# EAGLE design controller v1 (EAGLE 6.4)
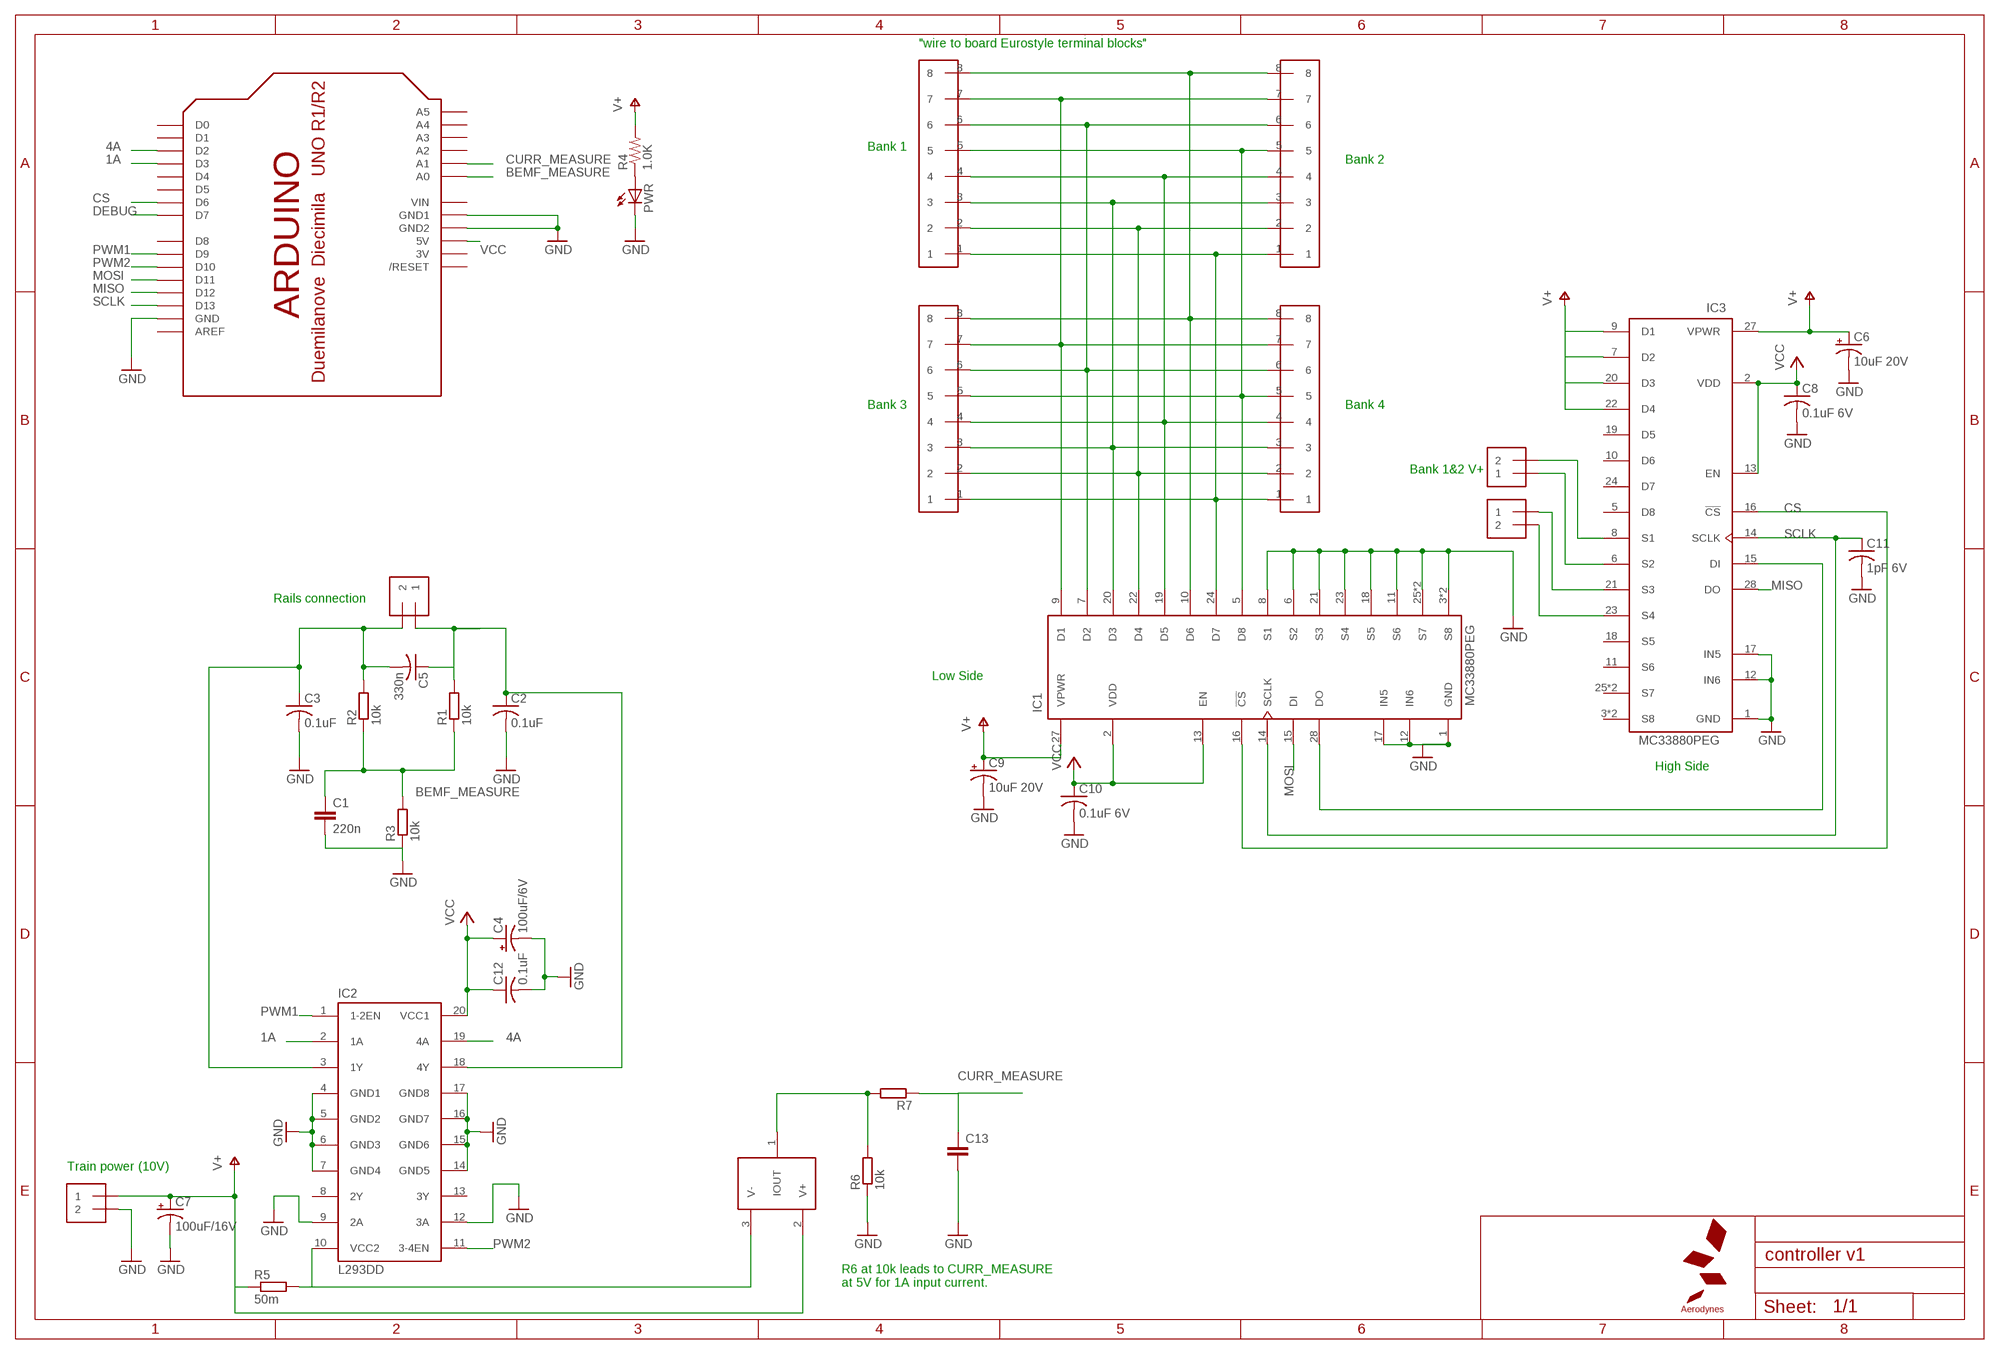
[diagram p0: schematic, sheet 1]

## Parts
BANK12  1X2-3.5MM  [1X2-3.5MM]
BANK34  1X2-3.5MM  [1X2-3.5MM]
C1  220n  C-EUC0805  [C0805]
C2  0.1uF  C-US025-025X050  [C025-025X050]
C3  0.1uF  C-US025-025X050  [C025-025X050]
C4  100uF/6V  CPOL-USE2.5-5  [E2,5-5]
C5  330n  C-US050-025X075  [C050-025X075]
C6  10uF 20V  CPOL-USE2,5-6E  [E2,5-6E]
C7  100uF/16V  CPOL-USE2.5-6  [E2,5-6]
C8  0.1uF 6V  C-US025-025X050  [C025-025X050]
C9  10uF 20V  CPOL-USE2,5-6E  [E2,5-6E]
C10  0.1uF 6V  C-US025-025X050  [C025-025X050]
C11  1pF 6V  C-USC0805K  [C0805K]
C12  0.1uF  C-US025-025X050  [C025-025X050]
C13  C-EUC0805K  [C0805K]
CON1  1X08-CONN3.5MM  [1X08-3.5MM]
CON2  1X08-CONN3.5MM  [1X08-3.5MM]
CON3  1X08-CONN3.5MM  [1X08-3.5MM]
CON4  1X08-CONN3.5MM  [1X08-3.5MM]
IC1  MC33880PEG  [SO28W]
IC2  L293DD  [SOIC20-2]
IC3  MC33880PEG  [SO28W]
PWR  LED3MM  [LED3MM]
R1  10k  R-EU_R0805  [R0805]
R2  10k  R-EU_R0805  [R0805]
R3  10k  R-EU_R0805  [R0805]
R4  1.0K  R-US_M0805  [M0805]
R5  50m  R-EU_M1206  [M1206]
R6  10k  R-EU_R0603  [R0603]
R7  R-EU_R0603  [R0603]
SL1  1X2-3.5MM  [1X2-3.5MM]
SL2  1X2-3.5MM  [1X2-3.5MM]
U$1  ARDUINO  [ARDUINO-NOCUT]
U$2  LOGO-AERODYNESSMALL  [LOGO-AERODYNES-S]
U$3  ZXCT1009-F  [SOT23-1TOP]

## Nets
1A: IC2.2(1A) U$1.D3
1Y: C3.1 C5.2 IC2.3(1Y) R2.2 SL1.2
4A: IC2.19(4A) U$1.D2
4Y: C2.1 C5.1 IC2.18(4Y) R1.2 SL1.1
BEMF_MEASURE: C1.1 R1.1 R2.1 R3.2 U$1.A0
CS: IC1.16(!CS) IC3.16(!CS) U$1.D6
CURR_MEASURE: C13.1 R7.1 U$1.A1
DEBUG: U$1.D7
GND: C1.2 C2.2 C3.2 C4.- C6.- C7.- C8.2 C9.- C10.2 C11.2 C12.2 C13.2 IC1.1(GND) IC1.3(S8) IC1.4(S8) IC1.6(S2) IC1.8(S1) IC1.11(S6) IC1.12(IN6) IC1.17(IN5) IC1.18(S5) IC1.21(S3) IC1.23(S4) IC1.25(S7) IC1.26(S7) IC2.4(GND1) IC2.5(GND2) IC2.6(GND3) IC2.7(GND4) IC2.9(2A) IC2.12(3A) IC2.14(GND5) IC2.15(GND6) IC2.16(GND7) IC2.17(GND8) IC3.1(GND) IC3.12(IN6) IC3.17(IN5) PWR.K(C) R3.1 R6.1 SL2.2 U$1.GND U$1.GND1 U$1.GND2
MISO: IC3.28(DO) U$1.D12
MOSI: IC1.15(DI) U$1.D11
N$1: BANK34.2 IC3.23(S4)
N$2: BANK34.1 IC3.21(S3)
N$3: BANK12.1 IC3.6(S2)
N$4: BANK12.2 IC3.8(S1)
N$5: IC2.10(VCC2) R5.2 U$3.3(V-)
N$6: R6.2 R7.2 U$3.1(IOUT)
N$7: CON1.3 CON2.3 CON3.3 CON4.3 IC1.20(D3)
N$8: CON1.4 CON2.4 CON3.4 CON4.4 IC1.19(D5)
N$9: CON1.5 CON2.5 CON3.5 CON4.5 IC1.5(D8)
N$11: CON1.1 CON2.1 CON3.1 CON4.1 IC1.24(D7)
N$12: CON1.8 CON2.8 CON3.8 CON4.8 IC1.10(D6)
N$13: IC1.28(DO) IC3.15(DI)
N$14: CON1.7 CON2.7 CON3.7 CON4.7 IC1.9(D1)
N$15: CON1.2 CON2.2 CON3.2 CON4.2 IC1.22(D4)
N$16: CON1.6 CON2.6 CON3.6 CON4.6 IC1.7(D2)
N$35: PWR.A R4.1
PWM1: IC2.1(1-2EN) U$1.D9
PWM2: IC2.11(3-4EN) U$1.D10
SCLK: C11.1 IC1.14(SCLK) IC3.14(SCLK) U$1.D13
V+: C6.+ C7.+ C9.+ IC1.27(VPWR) IC3.7(D2) IC3.9(D1) IC3.20(D3) IC3.22(D4) IC3.27(VPWR) R4.2 R5.1 SL2.1 U$3.2(V+)
VCC: C4.+ C8.1 C10.1 C12.1 IC1.2(VDD) IC1.13(EN) IC2.20(VCC1) IC3.2(VDD) IC3.13(EN) U$1.5V
Unconnected: IC2.8(2Y) IC2.13(3Y) IC3.3(S8) IC3.4(S8) IC3.5(D8) IC3.10(D6) IC3.11(S6) IC3.18(S5) IC3.19(D5) IC3.24(D7) IC3.25(S7) IC3.26(S7) U$1.A2 U$1.A3 U$1.A4 U$1.A5 U$1.AREF U$1.D0 U$1.D1 U$1.D4 U$1.D5 U$1.D8 U$1.RESET(/RESET)

## Notes on the sheet
- "wire to board Eurostyle terminal blocks"
- Bank 1
- Bank 2
- Bank 3 | Bank 4
- Bank 1&2 V+
- Rails connection
- Low Side
- High Side
- Train power (10V)
- R6 at 10k leads to CURR_MEASURE
  at 5V for 1A input current.

## Power pins joined to a net without a drawn wire
3V: U$1.3V
VIN: U$1.VIN

## Library data of the parts
BANK12 BANK34 SL1 SL2 = adafruit:1X2: 3.5mm Terminal block http://www.ladyada.net/library/pcb/eaglelibrary.html
C1 C13 = resistor:C-EU: CAPACITOR, European symbol
C2 C3 C8 C10-C12 = rcl-ez:C-US: CAPACITOR, American symbol
C4 = adafruit:CPOL-US: POLARIZED CAPACITOR, American symbol
C5 = adafruit:C-US: CAPACITOR, American symbol
C6 C9 = rcl:CPOL-US: POLARIZED CAPACITOR, American symbol
C7 = rcl-ez:CPOL-US: POLARIZED CAPACITOR, American symbol
CON1-CON4 = aerodynes:1X08-CONN: Generic 3.5mm pitch screw connector, 8 plots.
IC1 IC3 = aerodynes:MC33880: Freescale 33880 The 33880 device is an 8-output hardware configurable high side/ low side switch with 8-bit serial input control using the serial peripheral interface (SPI). Two of the outputs can be controlled directly via microcontroller for pulse-width modulation (PWM) applications. The 33880 controls various inductive or incandescent loads by directly interfacing with a microcontroller. The circuit's innovative monitoring and protection features include very low standby currents, “cascadable” fault reporting, internal 40 V output clamping for low side configurations, internal -20 V output clamping for high side configurations, output specific diagnostics, and independent shutdown of outputs.
IC2 = aerodynes:L293D: The Device is a monolithic integrated high voltage, high current four channel driver designed to accept standard DTL or TTL logic levels and drive inductive loads (such as relays solenoides, DC and stepping motors) and switching power transistors. To simplify use as two bridges each pair of channels is equipped with an enable input. A separate supply input is provided for the logic, allowing operation at a lower voltage and internal clamp diodes are included. This device is suitable for use in switching applications at frequencies up to 5 kHz.
PWR = minimidi:LED: LED OSRAM: - CHIPLED LG R971, LG N971, LY N971, LG Q971, LY Q971, LO R971, LY R971 LH N974, LH R974 LS Q976, LO Q976, LY Q976 LO Q996 - Hyper CHIPLED LW Q18S LB Q993, LB Q99A, LB R99A - SideLED LS A670, LO A670, LY A670, LG A670, LP A670 LB A673, LV A673, LT A673, LW A673 LH A674 LY A675 LS A676, LA A676, LO A676, LY A676, LW A676 LS A679, LY A679, LG A679 - Hyper Micro SIDELED® LS Y876, LA Y876, LO Y876, LY Y876 LT Y87S - SmartLED LW L88C, LW L88S LB L89C, LB L89S, LG L890 LS L89K, LO L89K, LY L89K LS L896, LA L896, LO L896, LY L896 - TOPLED LS T670, LO T670, LY T670, LG T670, LP T670 LSG T670, LSP T670, LSY T670, LOP T670, LYG T670 LG T671, LOG T671, LSG T671 LB T673, LV T673, LT T673, LW T673 LH T674 LS T676, LA T676, LO T676, LY T676, LB T676, LH T676, LSB T676, LW T676 LB T67C, LV T67C, LT T67C, LS T67K, LO T67K, LY T67K, LW E67C LS E67B, LA E67B, LO E67B, LY E67B, LB E67C, LV E67C, LT E67C LW T67C LS T679, LY T679, LG T679 LS T770, LO T770, LY T770, LG T770, LP T770 LB T773, LV T773, LT T773, LW T773 LH T774 LS E675, LA E675, LY E675, LS T675 LS T776, LA T776, LO T776, LY T776, LB T776 LHGB T686 LT T68C, LB T68C - Hyper Mini TOPLED® LB M676 - Mini TOPLED Santana® LG M470 LS M47K, LO M47K, LY M47K Source: http://www.osram.convergy.de/
R1-R3 R5-R7 = resistor:R-EU_: RESISTOR, European symbol
R4 = rcl-ez:R-US_: RESISTOR, American symbol
U$1 = aerodynes:ARDUINO
U$2 = aerodynes:LOGO-AERODYNES
U$3 = aerodynes:ZXCT1009: The ZXCT1009 is a high side current sense monitor. Using this device eliminates the need to disrupt the ground plane when sensing a load current. It takes a high side voltage developed across a current shunt resistor and translates it into a proportional output current. A user defined output resistor scales the output current into a ground-referenced voltage. The wide input voltage range of 20V down to as low as 2.5V make it suitable for a range of applications. A minimum operating current of just 4µA, combined with a SOT23 package make it a unique solution for portable battery equipment. The SM8 device offers an alternative package option. http://www.diodes.com/datasheets/ZXCT1009.pdf

## Net classes
1 power: width 0.61 mm

## Board
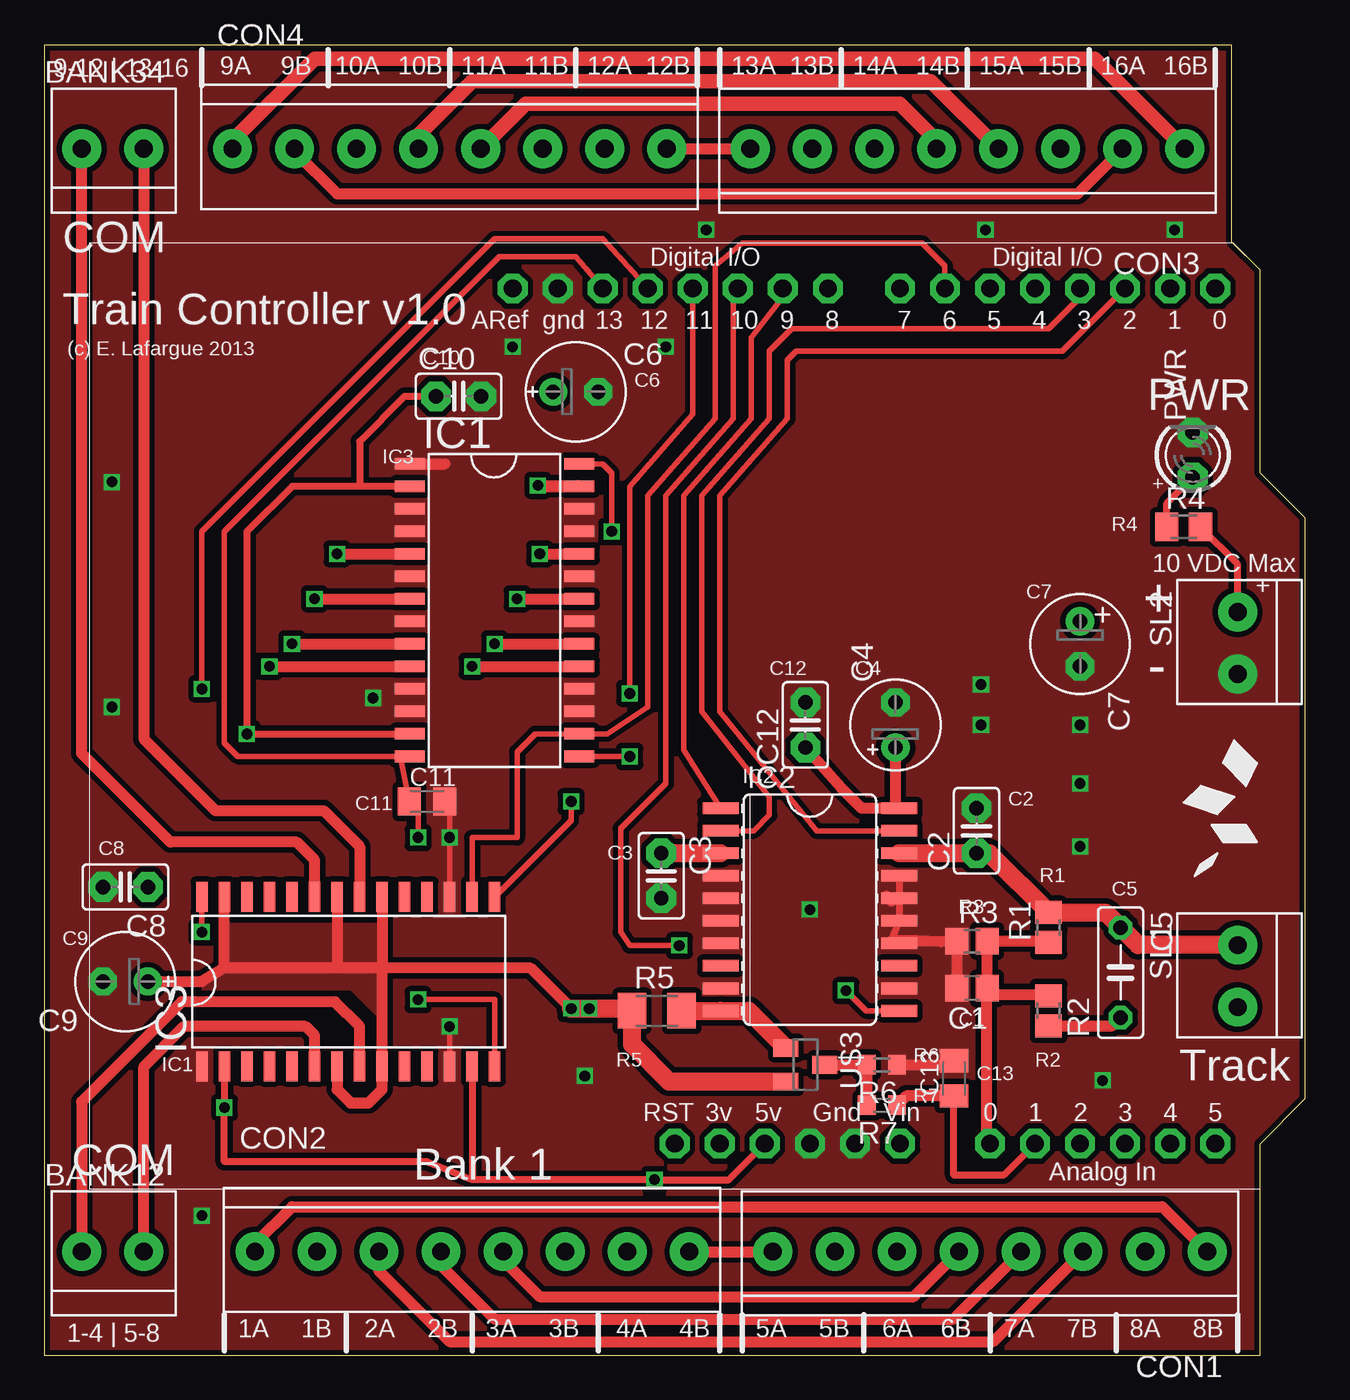
[diagram p1: board, top side]
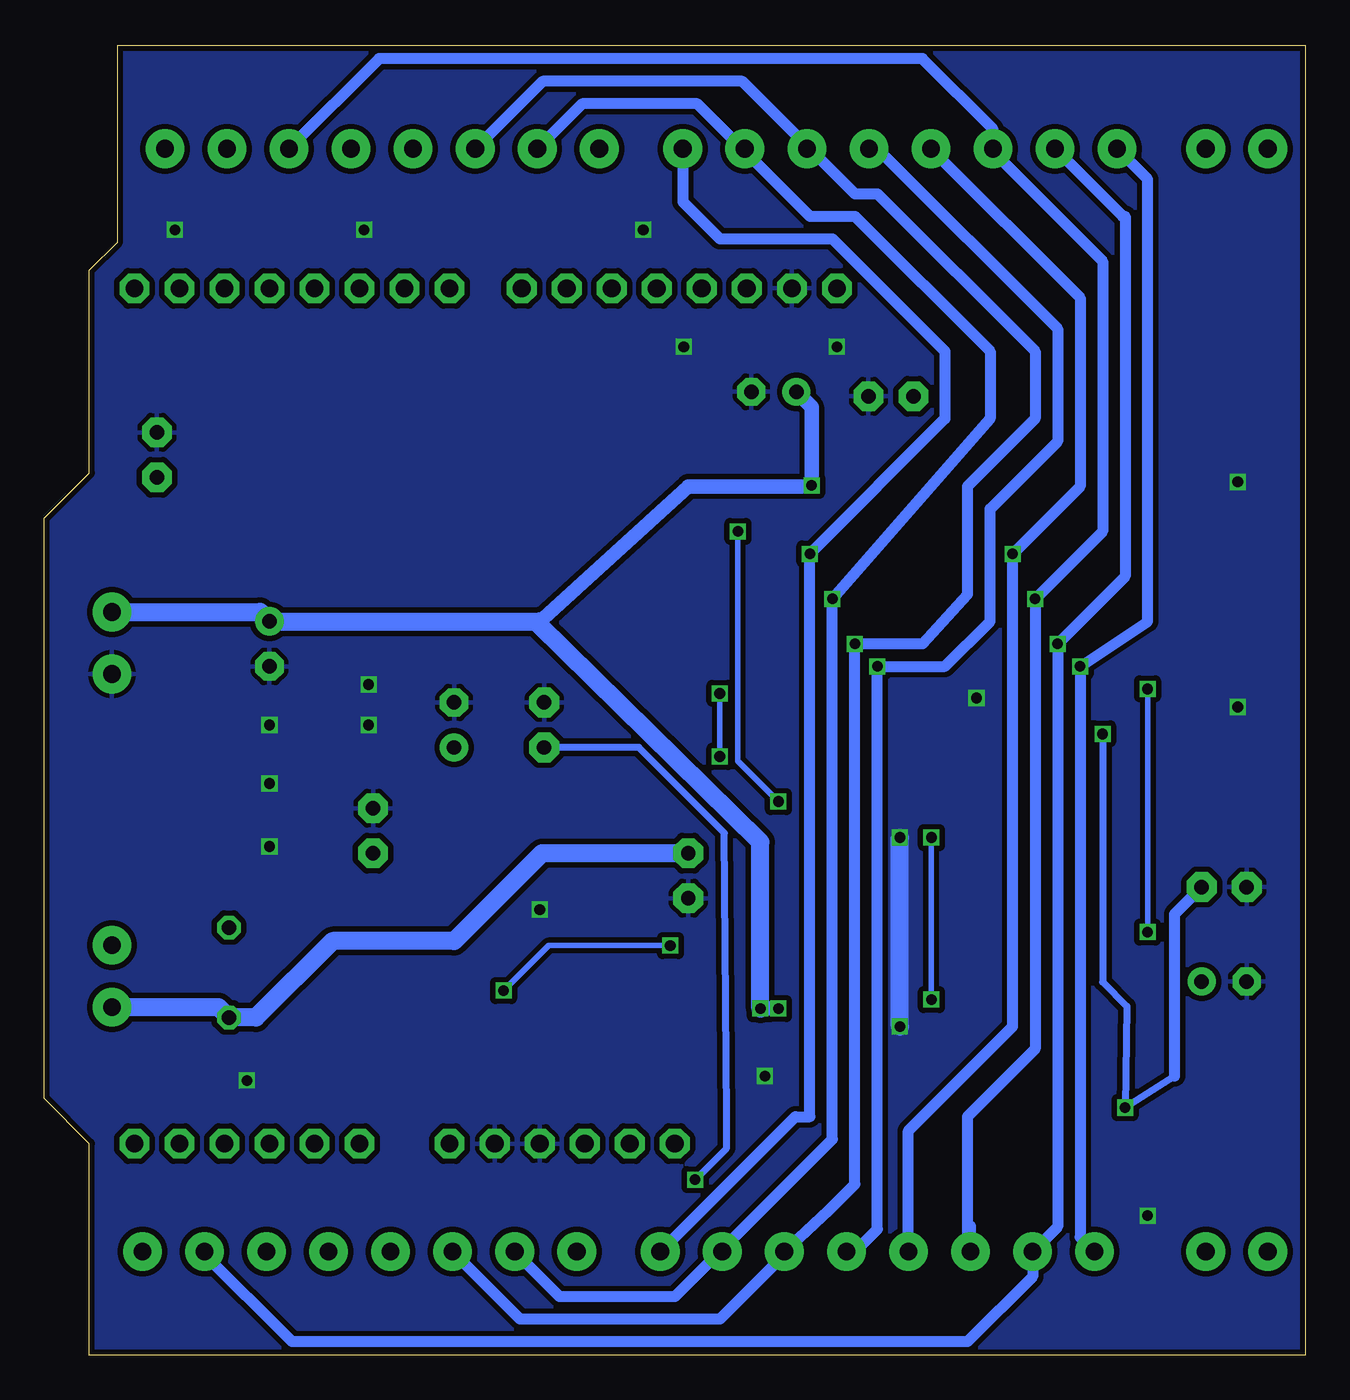
[diagram p2: board, bottom side, seen from below]

Size 71.12 x 73.9 mm. Coordinates in mm from the lower left corner, seen from the top.
Outline: 0,0 68.58,0 68.58,11.94 71.12,14.48 71.12,47.24 68.58,49.78 68.58,61.21 66.98,62.81 66.98,73.9 0,73.9 0,0
Copper layers (1*16): Top 0.035mm / dielectric 1.5mm / Bottom 0.035mm
Design rules "Fusion_eagle_rule_v1.1": minimum track width 6mil, minimum drill 12mil, track to track 6mil, track to pad 6mil, pad to pad 6mil, via to via 6mil, smd to smd 0mil, copper to edge 10mil, drill to drill 10mil, minimum pad ring 10mil, minimum via ring 6mil, stop-mask expansion 2mil, vias tented up to drill 100mil, thermal gap 10mil

### Footprints (pad centres in the part's own frame; a part is rotated, then mirrored left to right if it is on the bottom)
1X2-3.5MM = drill 1 pad 2.184: 1 1.8,0; 2 -1.7,0
C0805 = smd 1.3 x 1.5: 1 -0.85,0; 2 0.85,0
C025-025X050 = drill 0.813 pad 1.676 octagon: 1 -1.27,0; 2 1.27,0
E2,5-5 = drill 0.813 pad 1.6: + -1.27,0 | drill 0.813 pad 1.6 octagon: - 1.27,0
C050-025X075 = drill 0.813 octagon: 1 -2.54,0; 2 2.54,0
E2,5-6E = drill 0.813 pad 1.575: + -1.27,0 | drill 0.813 pad 1.575 octagon: - 1.27,0
E2,5-6 = drill 0.813 pad 1.6: + -1.27,0 | drill 0.813 pad 1.6 octagon: - 1.27,0
C0805K = smd 1.3 x 1.6: 1 -1,0; 2 1,0
1X08-3.5MM = drill 1 pad 2.184: 1 -12.25,0; 2 -8.75,0; 3 -5.25,0; 4 -1.75,0; 5 1.75,0; 6 5.25,0; 7 8.75,0; 8 12.25,0
SO28W = smd 0.65 x 1.7: 1 -11.43,-3.51; 2 -10.16,-3.51; 3 -8.89,-3.51; 4 -7.62,-3.51; 5 -6.35,-3.51; 6 -5.08,-3.51; 7 -3.81,-3.51; 8 -2.54,-3.51; 9 -1.27,-3.51; 10 0,-3.51; 11 1.27,-3.51; 12 2.54,-3.51; 13 3.81,-3.51; 14 5.08,-3.51; 15 5.08,6.05; 16 3.81,6.05; 17 2.54,6.05; 18 1.27,6.05; 19 0,6.05; 20 -1.27,6.05; 21 -2.54,6.05; 22 -3.81,6.05; 23 -5.08,6.05; 24 -6.35,6.05; 25 -7.62,6.05; 26 -8.89,6.05; 27 -10.16,6.05; 28 -11.43,6.05
SOIC20-2 = smd 0.66 x 2.032: 1 -5.715,-5.029; 2 -4.445,-5.029; 3 -3.175,-5.029; 4 -1.905,-5.029; 5 -0.635,-5.029; 6 0.635,-5.029; 7 1.905,-5.029; 8 3.175,-5.029; 9 4.445,-5.029; 10 5.715,-5.029; 11 5.715,5.029; 12 4.445,5.029; 13 3.175,5.029; 14 1.905,5.029; 15 0.635,5.029; 16 -0.635,5.029; 17 -1.905,5.029; 18 -3.175,5.029; 19 -4.445,5.029; 20 -5.715,5.029
LED3MM = drill 0.813 pad 1.676 octagon: A -1.27,0; K 1.27,0
R0805 = smd 1.3 x 1.5: 1 -0.85,0; 2 0.85,0
M0805 = smd 1.3 x 1.6: 1 -0.95,0; 2 0.95,0
M1206 = smd 1.6 x 2: 1 -1.4,0; 2 1.4,0
R0603 = smd 1 x 1.1: 1 -0.85,0; 2 0.85,0
ARDUINO-NOCUT = drill 1 pad 1.676 octagon: 3V 24.13,-33.02; 5V 26.67,-33.02; A0 39.37,-33.02; A1 41.91,-33.02; A2 44.45,-33.02; A3 46.99,-33.02; A4 49.53,-33.02; A5 52.07,-33.02; AREF 12.446,15.24; D0 52.07,15.24; D1 49.53,15.24; D2 46.99,15.24; D3 44.45,15.24; D4 41.91,15.24; D5 39.37,15.24; D6 36.83,15.24; D7 34.29,15.24; D8 30.226,15.24; D9 27.686,15.24; D10 25.146,15.24; D11 22.606,15.24; D12 20.066,15.24; D13 17.526,15.24; GND 14.986,15.24; GND1 31.75,-33.02; GND2 29.21,-33.02; RESET 21.59,-33.02; VIN 34.29,-33.02
SOT23-1TOP = smd 1 x 1.4: 1 0,1.1; 2 0.95,-1.1; 3 -0.95,-1.1

### Placement (x,y rotation side)
BANK12  3.81,5.84 0 top
BANK34  3.81,68.07 0 top
C1  52.32,20.7 180 top
C2  52.58,29.59 90 top
C3  34.8,27.05 270 top
C4  48.01,35.56 90 top
C5  60.71,21.59 270 top
C6  29.97,54.36 0 top
C7  58.42,40.13 270 top
C8  4.57,26.42 180 top
C9  4.57,21.08 180 top
C10  23.37,54.1 0 top
C11  21.59,31.24 0 top
C12  42.93,35.56 90 top
C13  51.31,15.62 90 top
CON1  53.34,5.84 0 top
CON2  24.13,5.84 180 top
CON3  52.07,68.07 0 top
CON4  22.86,68.07 180 top
IC1  24.13,38.86 270 top
IC2  43.18,25.15 270 top
IC3  20.32,19.81 0 top
PWR  64.77,50.8 90 top
R1  56.64,24.13 90 top
R2  56.64,19.43 270 top
R3  52.32,23.37 0 top
R4  64.26,46.74 0 top
R5  34.54,19.43 0 top
R6  47.24,16.38 180 top
R7  47.24,14.1 180 top
SL1  67.31,21.34 90 top
SL2  67.31,40.13 90 top
U$1  13.97,44.96 0 top
U$2  66.8,31.5 0 top
U$3  42.93,16.38 270 top

### Tracks (layer width: path | path; a pad name or v marks a point on that pad's centre or on a via)
1A
  Top 0.305: IC2.2 40,29.59 40.89,30.48 40.89,31.5 37.08,36.32 37.08,48.51 40.89,52.83 40.89,56.64 42.16,57.91 56.64,57.91 58.42,59.69 U$1.D3
1Y
  Top 0.61: R2.2 60.24,18.58 C5.2
  Top 1.016: IC2.3 C3.1
  Bottom 1.016: C3.1 43.05,28.32 48.01,23.37 54.86,23.37 59.18,19.05 C5.2 61.29,19.64 SL1.2
4A
  Top 0.305: U$1.D2 57.4,56.64 42.42,56.64 41.91,56.13 41.91,52.83 38.1,48.51 38.1,36.32 43.56,29.59 IC2.19
4Y
  Top 1.016: SL1.1 61.7,23.14 C5.1 59.86,24.98 R1.2 53.3,28.32 C2.1 IC2.18
BEMF_MEASURE
  Top 0.61: 53.13,20.36 C1.1 R3.2 56.55,23.37 R1.1 | 53.13,20.36 56.56,20.36 R2.1 | 53.13,20.36 53.13,12.14 U$1.A0
CS
  Top 0.305: U$1.D6 50.8,61.47 49.53,62.74 39.37,62.74 37.85,61.47 37.85,52.83 34.04,48.51 34.04,36.58 31.75,35.05 IC1.16 27.69,35.05 26.67,34.04 26.67,29.21 24.13,29.21 IC3.16
CURR_MEASURE
  Top 0.406: U$1.A1 54.1,10.16 51.31,10.16 C13.1
  Top 0.61: C13.1 48.62,14.62 R7.1
GND  (via drill 0.6)
  Top 0.305: IC3.17 v22.86,29.21 22.86,30.99 C11.2 | IC3.12 v22.86,18.54
  Top 0.406: IC2.17 IC2.16 IC2.15 47.78,23.37
  Top 0.61: IC1.1 22.61,50.29 | C1.2 R3.1 50.58,23.33 49.28,23.37 47.78,23.37 IC2.14 | 47.78,25.63 47.5,25.91 | R6.1 51.07,16.38 C13.2
  Bottom 1.016: v22.86,18.54 v22.86,29.21
  other vias: 3.81,36.58 18.54,37.08 52.83,37.85 58.42,28.7 30.48,15.75 43.18,25.15 58.42,32.26 58.42,35.56 52.83,35.56 63.75,63.5 53.09,63.5 37.34,63.5 26.42,56.9 35.05,56.9 3.81,49.28 8.89,7.87 59.69,15.49
  pour Top (isolate 0.305, rank 2, no thermals): -0.76,74.68 68.07,74.68 68.07,63.5 70.1,61.47 70.1,49.78 72.64,47.24 72.64,13.97 69.85,11.18 69.85,-1.02 -1.02,-1.02
  pour Bottom (isolate 0.305, rank 2): -1.78,-0.51 -1.78,74.93 72.39,74.93 72.39,74.42 72.39,-1.52 -2.03,-1.52
MISO  (via drill 0.6)
  Top 0.305: U$1.D12 31.5,62.99 25.4,62.99 8.89,46.48 v8.89,37.59 | v8.89,23.88 IC3.28
  Bottom 0.305: v8.89,37.59 v8.89,23.88
MOSI  (via drill 0.6)
  Top 0.305: U$1.D11 36.58,53.09 33.02,49.02 v33.02,37.34 | v33.02,33.78 IC1.15
  Bottom 0.305: v33.02,37.34 v33.02,33.78
N$1
  Top 0.61: IC3.23 15.24,27.94 14.22,28.96 7.11,28.96 2.11,33.96 BANK34.2
N$2
  Top 0.61: BANK34.1 5.61,34.78 9.65,30.73 15.75,30.73 17.78,28.7 IC3.21
N$3
  Top 0.61: IC3.6 15.24,18.03 14.73,18.54 7.87,18.54 5.61,16.28 BANK12.1
N$4
  Top 0.61: IC3.8 17.78,18.54 16.38,19.94 7.75,19.94 2.11,14.3 BANK12.2
N$5
  Top 1.016: IC2.10 R5.2 39.73,19.43 U$3.3
N$6
  Top 0.61: U$3.1 R6.2 R7.2
N$7  (via drill 0.6)
  Top 0.61: v25.4,40.13 IC1.20
  Bottom 0.61: CON3.3 43.01,71.88 31.75,71.88 28.11,68.24 CON4.3 27.94,68.07 25.4,65.53 24.13,65.53 15.24,56.64 15.24,52.83 19.05,49.02 19.05,42.93 21.59,40.13 v25.4,40.13 25.4,9.65 26.84,8.21 CON2.3 29.38,5.67 33.02,2.03 44.28,2.03 CON1.3
N$8  (via drill 0.6)
  Top 0.61: CON2.4 25.88,5.36 27.94,3.3 49.05,3.3 CON1.4 | CON3.4 50.32,68.55 | v24.13,38.86 IC1.19
  Top 0.813: 50.32,68.55 48.26,70.61 27.15,70.61 CON4.4
  Bottom 0.61: CON2.4 25.4,5.84 24.13,7.11 v24.13,38.86 20.32,38.86 17.78,41.4 17.78,47.75 13.97,51.56 13.97,57.91 24.13,68.07 CON4.4
N$9  (via drill 0.6)
  Top 0.61: CON4.5 21.11,68.86 | CON2.5 22.38,5.05 25.4,2.03 51.28,2.03 CON1.5 | v16.51,45.21 IC1.5
  Top 0.813: 21.11,68.86 24.13,71.88 50.01,71.88 CON3.5
  Bottom 0.61: CON2.5 22.38,12.67 16.51,18.54 v16.51,45.21 12.7,49.02 12.7,59.66 CON4.5
N$11  (via drill 0.6)
  Top 0.61: CON4.1 CON3.1 | CON2.1 CON1.1 | v27.94,45.21 IC1.24
  Bottom 0.61: CON2.1 28.76,13.46 27.94,13.46 v27.94,45.21 20.32,52.83 20.32,56.64 26.67,62.99 33.02,62.99 35.11,65.08 CON4.1
N$12  (via drill 0.6)
  Top 0.61: CON4.8 10.61,68.52 | CON2.8 11.88,6.29 13.97,8.38 63.05,8.38 CON1.8 | v12.7,38.86 IC1.10
  Top 0.813: 10.61,68.52 15.24,73.15 59.24,73.15 CON3.8
  Bottom 0.61: CON4.8 8.89,66.35 8.89,41.4 v12.7,38.86 12.7,6.66 CON2.8
N$13  (via drill 0.6)
  Top 0.305: IC3.15 29.72,30.18 v29.72,31.24 | v32,46.48 32,49.78 31.5,50.29 IC1.28
  Bottom 0.305: v29.72,31.24 32,33.53 v32,46.48
N$14  (via drill 0.6)
  Top 0.61: CON4.7 14.11,67.93 16.51,65.53 58.28,65.53 CON3.7 | v13.97,40.13 IC1.9
  Bottom 0.61: CON1.7 62.23,5.84 57.15,0.76 19.05,0.76 15.38,4.43 CON2.7 13.97,7.25 v13.97,40.13 10.16,43.94 10.16,64.26 10.3,64.26 CON4.7
N$15  (via drill 0.6)
  Top 0.61: v26.67,42.67 IC1.22
  Bottom 0.61: CON3.2 40.78,70.61 34.29,70.61 31.75,68.07 CON4.2 31.61,67.93 27.94,64.26 25.4,64.26 17.78,56.64 17.78,52.83 v26.67,42.67 26.67,12.19 33.02,5.84 | CON2.2 33.02,5.84 | 33.02,5.84 35.56,3.3 42.05,3.3 CON1.2
N$16  (via drill 0.6)
  Top 0.61: CON2.6 18.88,4.74 22.86,0.76 53.51,0.76 CON1.6 | v15.24,42.67 IC1.7
  Bottom 0.61: CON3.6 52.24,73.15 21.59,73.15 17.61,69.17 CON4.6 17.61,67.9 11.43,61.72 11.43,46.48 v15.24,42.67 15.24,17.27 19.05,13.46 19.05,5.84 CON2.6 18.88,7.28
N$35
  Top 0.406: R4.1 63.31,48.07 PWR.A
PWM1
  Top 0.305: U$1.D9 41.66,59.69 39.88,57.4 39.88,52.83 36.07,48.51 36.07,34.13 IC2.1
PWM2  (via drill 0.6)
  Top 0.305: v35.81,23.11 33.02,23.11 32.51,23.88 32.51,29.72 35.05,32.26 35.05,48.51 38.86,52.83 38.86,60.2 U$1.D10 | v45.21,20.57 46.36,19.43 IC2.11
  Bottom 0.305: v35.81,23.11 42.67,23.11 v45.21,20.57
SCLK  (via drill 0.6)
  Top 0.305: U$1.D13 29.97,61.98 25.65,61.98 10.16,46.48 10.16,34.54 10.92,33.78 20.07,33.78 | 20.07,33.78 IC1.14 | 20.07,33.78 C11.1 21.08,30.48 v21.08,29.21 | IC3.14 25.4,20.07 v21.08,20.07
  Bottom 0.305: v21.08,20.07 v21.08,29.21
V+  (via drill 0.6)
  Top 0.406: SL2.1 67.31,44.64 R4.2
  Top 0.61: 10.16,21.84 IC3.27 | 19.05,21.84 27.43,21.84 v29.72,19.56 | 19.05,21.84 16.51,21.84 | 16.51,21.84 10.16,21.84 | C9.+ 8.89,21.08 10.16,21.84 | IC3.22 16.51,21.84 | IC3.20 19.05,21.84 | 19.05,21.84 IC3.9 19.05,14.99 18.29,14.22 17.27,14.22 16.51,14.99 IC3.7 | v27.84,49.07 27.94,49.02 IC1.27 30.13,49.07 v27.84,49.07
  Top 1.016: U$3.2 35.24,15.43 33.15,17.53 R5.1 33.02,19.56 v30.73,19.56 v29.72,19.56
  Bottom 0.61: 27.89,49.02 v27.84,49.07
  Bottom 0.813: 27.89,49.02 34.8,49.02 43.3,41.28 43.18,41.4 | C6.+ 27.84,53.49 v27.84,49.07 | v29.72,19.56 v30.73,19.56
  Bottom 1.016: v30.73,19.56 30.73,28.96 43.3,41.28 | 43.18,41.4 C7.+ 58.95,41.93 SL2.1
  pour Top: 8.89,21.34 10.16,22.1 10.16,24.38 19.05,24.38 19.05,18.8 17.27,20.57 8.89,20.57
VCC  (via drill 0.6)
  Top 0.406: IC1.2 17.78,49.02 | 17.78,49.02 13.97,49.02 11.43,46.48 v11.43,35.05 IC1.13 | 24.13,9.91 v34.42,9.91 38.61,9.91 U$1.5V | IC3.13 24.13,9.91 | 24.13,9.91 21.59,10.92 10.16,10.92 v10.16,13.97 IC3.2 | 17.78,49.02 17.78,51.56 20.32,54.1 C10.1
  Top 0.61: C12.1 44.96,32 46.1,30.86 IC2.20 48.01,31.09 C4.+
  Bottom 0.406: v11.43,35.05 11.43,21.06 10.06,19.68 10.06,19.66 v10.16,13.97 7.37,15.75 | v34.42,9.91 32.64,11.68 32.64,13.46 32.77,29.46 37.59,34.29 C12.1
  Bottom 0.61: 7.37,15.75 7.37,24.89 C8.1

### Text on the board
tPlace: 9-12 | 13-16 | 9A | 9B | 10A | 10B | 11A | 11B | 12A | 12B | 13A | 13B | 14A | 14B | 15A | 15B | 16A | 16B | COM | Train Controller v1.0 | (c) E. Lafargue 2013 | C10 | C6 | PWR | IC3 | + | R4 | 10 VDC Max | C7 | + | + | C12 | C4 | - | IC2 | C11 | C2 | C8 | C3 | R1 | C5 | R3 | C9 | C1 | IC1 | R5 | R6 | R2 | C13 | Track | R7 | COM | Bank 1 | 1A | 1B | 2A | 2B | 3A | 3B | 4A | 4B | 5A | 5B | 6A | 6B | 6B | 7A | 7B | 8A | 8B | 1-4 | 5-8